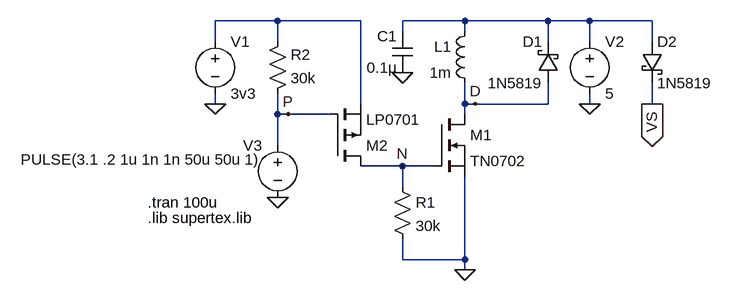
[diagram p0: schematic fet.asc]
fet.asc, the LTspice schematic file:
Version 4
SHEET 1 880 680
WIRE -64 -16 -160 -16
WIRE 64 -16 -64 -16
WIRE 224 -16 128 -16
WIRE 352 -16 224 -16
WIRE 416 -16 352 -16
WIRE 512 -16 416 -16
WIRE 128 0 128 -16
WIRE 224 0 224 -16
WIRE -160 16 -160 -16
WIRE -64 16 -64 -16
WIRE 352 16 352 -16
WIRE 416 16 416 -16
WIRE 512 16 512 -16
WIRE -160 112 -160 96
WIRE 64 112 64 -16
WIRE 224 112 224 80
WIRE 240 112 224 112
WIRE 352 112 352 80
WIRE 352 112 240 112
WIRE 416 112 416 96
WIRE 512 112 512 80
WIRE -64 128 -64 96
WIRE -48 128 -64 128
WIRE 16 128 -48 128
WIRE 224 128 224 112
WIRE -64 176 -64 128
WIRE 128 208 64 208
WIRE 176 208 128 208
WIRE 128 240 128 208
WIRE 128 352 128 320
WIRE 224 352 224 224
WIRE 224 352 128 352
WIRE 224 368 224 352
FLAG 416 112 0
FLAG -160 112 0
FLAG -64 256 0
FLAG 224 368 0
FLAG 240 112 D
FLAG -48 128 P
FLAG 128 208 N
FLAG 512 112 VS
IOPIN 512 112 Out
FLAG 128 64 0
SYMBOL Res -80 112 M180
WINDOW 0 36 76 Left 2
WINDOW 3 36 40 Left 2
SYMATTR InstName R2
SYMATTR Value 30k
SYMBOL Voltage -160 0 R0
SYMATTR InstName V1
SYMATTR Value 3v3
SYMBOL Voltage 416 0 R0
SYMATTR InstName V2
SYMATTR Value 5
SYMATTR SpiceLine Rser=1
SYMBOL Voltage -64 160 M0
WINDOW 3 24 38 Left 2
SYMATTR Value PULSE(3.1 .2 1u 1n 1n 50u 50u 1)
SYMATTR InstName V3
SYMBOL Res 112 224 R0
SYMATTR InstName R1
SYMATTR Value 30k
SYMBOL nmos 176 128 R0
SYMATTR InstName M1
SYMATTR Value TN0702
SYMBOL pmos 16 208 M180
SYMATTR InstName M2
SYMATTR Value LP0701
SYMBOL schottky 368 80 R180
WINDOW 0 24 64 Left 2
WINDOW 3 24 0 Left 2
SYMATTR InstName D1
SYMATTR Value 1N5819
SYMBOL ind 240 -16 M0
SYMATTR InstName L1
SYMATTR Value 1m
SYMATTR SpiceLine Rser=45
SYMBOL schottky 496 16 R0
SYMATTR InstName D2
SYMATTR Value 1N5819
SYMBOL cap 144 0 M0
SYMATTR InstName C1
SYMATTR Value 0.1µ
TEXT -264 264 Left 2 !.tran 100u
TEXT -264 288 Left 2 !.lib supertex.lib

The netlist it stands for:
* fet.asc
R2 P N001 30k
V1 N001 0 3v3
V2 N002 0 5 Rser=1
V3 P 0 PULSE(3.1 .2 1u 1n 1n 50u 50u 1)
R1 N 0 30k
M1 D N 0 0 TN0702
M2 N P N001 N001 LP0701
D1 D N002 1N5819
L1 N002 D 1m Rser=45
D2 N002 VS 1N5819
C1 N002 0 0.1µ
.model D D
.lib standard.dio
.model NMOS NMOS
.model PMOS PMOS
.lib standard.mos
.tran 100u
.lib supertex.lib
.backanno
.end